# EAGLE design floppycontrol_mcu (EAGLE 9.6.2)
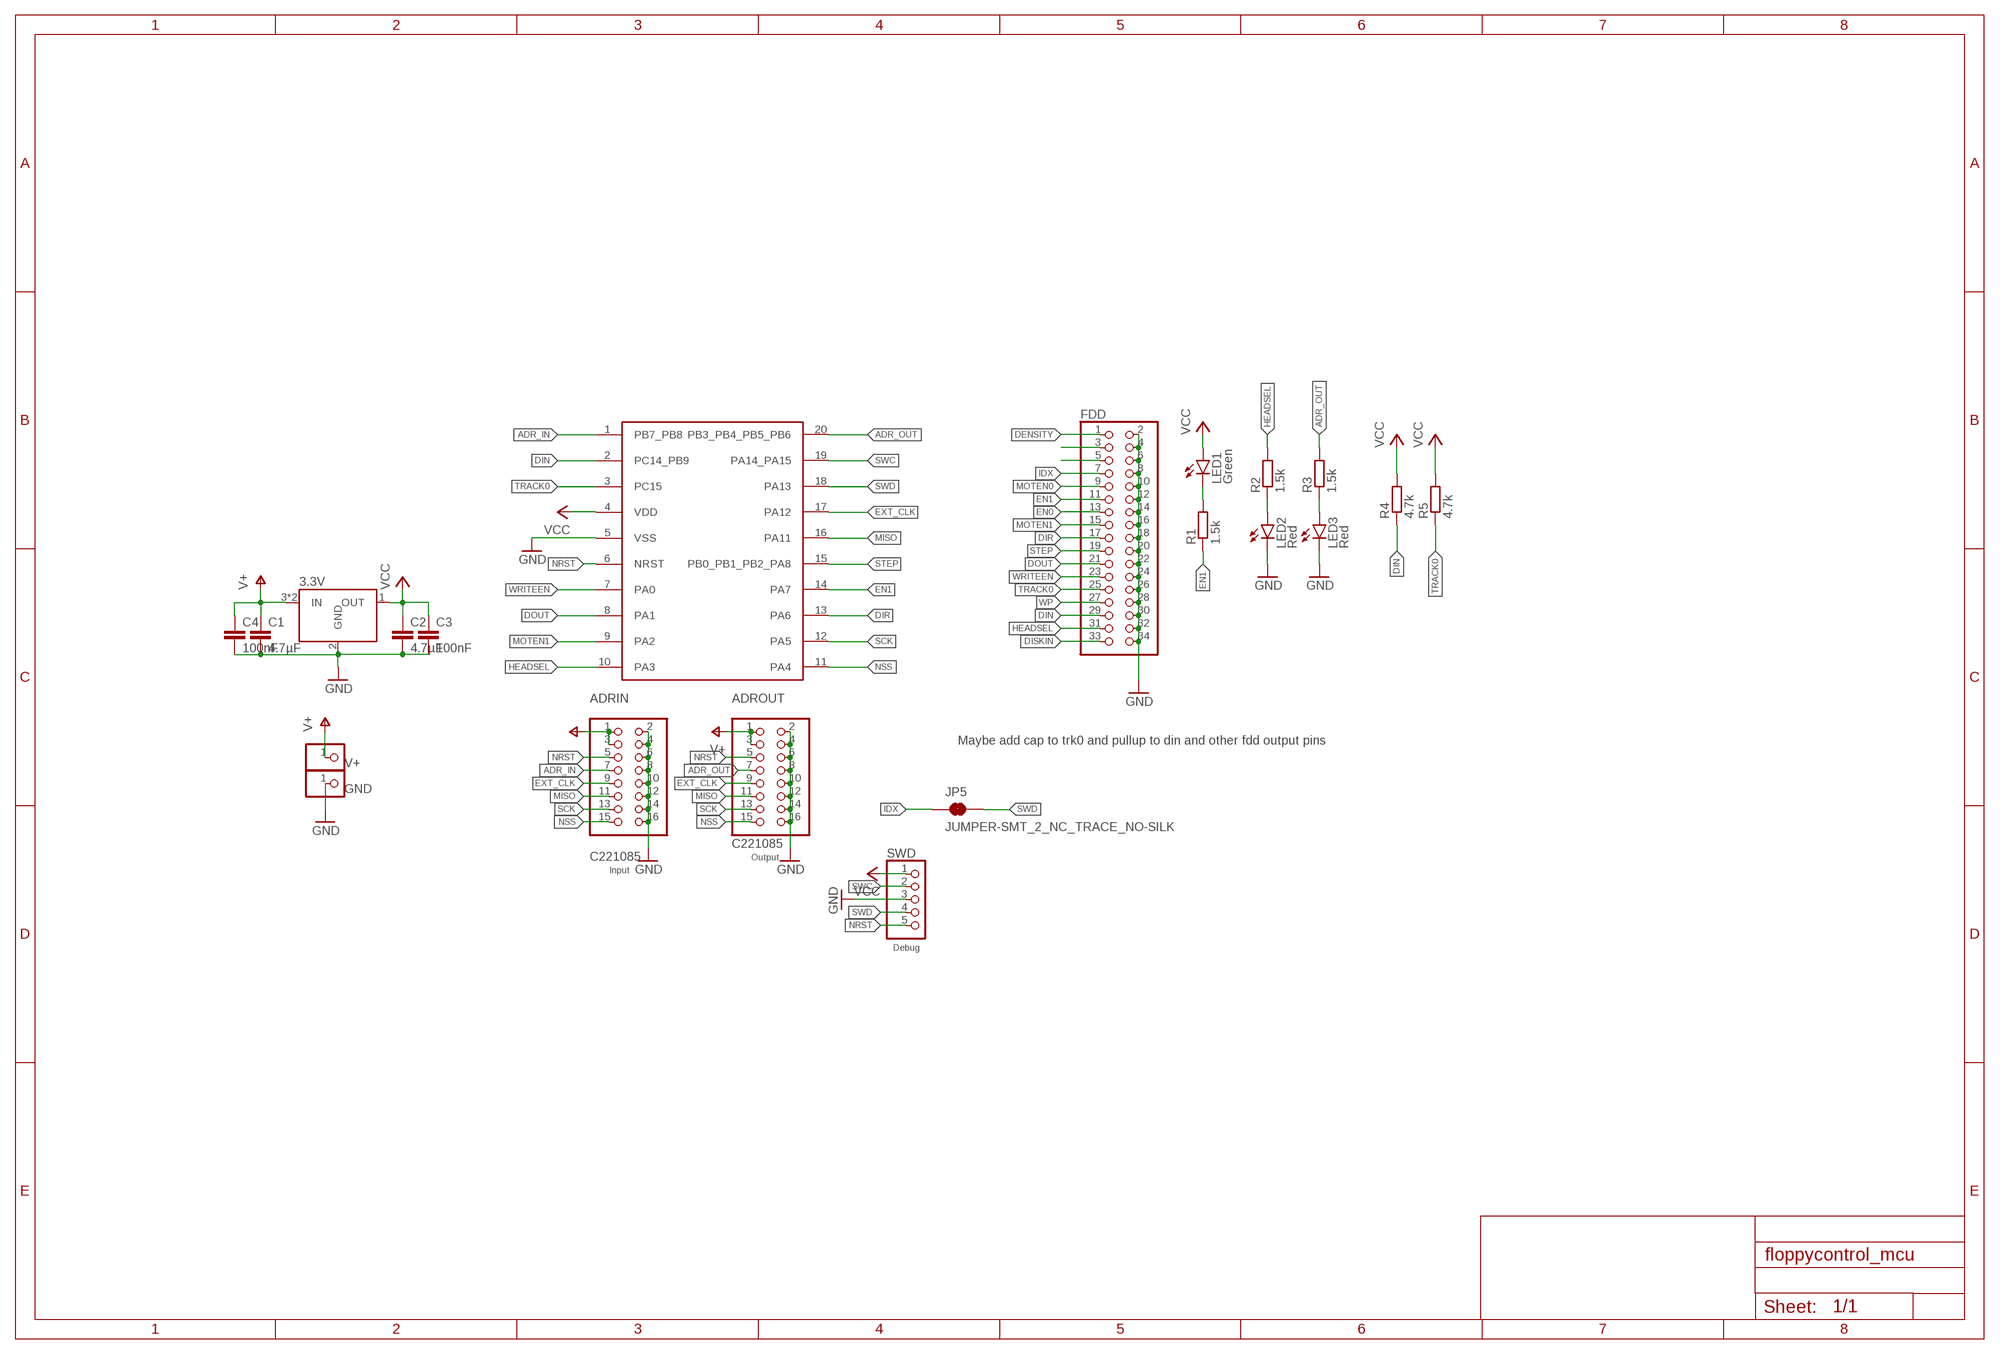
[diagram p0: schematic, sheet 1]

## Parts
ADRIN  C221085  PINHD-2X8/90  [2X08/90]
ADROUT  C221085  PINHD-2X8/90  [2X08/90]
C1  4.7µF  C-EUC0603  [C0603]
C2  4.7µF  C-EUC0603  [C0603]
C3  100nF  C-EUC0603  [C0603]
C4  100nF  C-EUC0603  [C0603]
FDD  PINHD-2X17/90  [2X17/90]
GND  PINHD-1X1  [1X01]
JP5  JUMPER-SMT_2_NC_TRACE_NO-SILK  [SMT-JUMPER_2_NC_TRACE_NO-SILK]
LED1  Green  LEDCHIP-LED0805  [CHIP-LED0805]
LED2  Red  LEDCHIP-LED0805  [CHIP-LED0805]
LED3  Red  LEDCHIP-LED0805  [CHIP-LED0805]
R1  1.5k  R-EU_R0603  [R0603]
R2  1.5k  R-EU_R0603  [R0603]
R3  1.5k  R-EU_R0603  [R0603]
R4  4.7k  R-EU_R0603  [R0603]
R5  4.7k  R-EU_R0603  [R0603]
SWD  PINHD-1X5  [1X05]
U1  STM32G030F6P6TSSOP20  [TSSOP20]
U2  3.3V  LDO_FIXEDSOT89_GND_VIN_VOUT  [SOT89-R]
V+  PINHD-1X1  [1X01]

## Nets
ADR_IN: ADRIN.7 U1.1(PB7_PB8)
ADR_OUT: ADROUT.7 R3.2 U1.20(PB3_PB4_PB5_PB6)
DENSITY: FDD.1
DIN: FDD.29 R4.1 U1.2(PC14_PB9)
DIR: FDD.17 U1.13(PA6)
DISKIN: FDD.33
DOUT: FDD.21 U1.8(PA1)
EN0: FDD.13
EN1: FDD.11 R1.1 U1.14(PA7)
EXT_CLK: ADRIN.9 ADROUT.9 U1.17(PA12)
GND: ADRIN.2 ADRIN.4 ADRIN.6 ADRIN.8 ADRIN.10 ADRIN.12 ADRIN.14 ADRIN.16 ADROUT.2 ADROUT.4 ADROUT.6 ADROUT.8 ADROUT.10 ADROUT.12 ADROUT.14 ADROUT.16 C1.2 C2.2 C3.2 C4.2 FDD.2 FDD.4 FDD.6 FDD.8 FDD.10 FDD.12 FDD.14 FDD.16 FDD.18 FDD.20 FDD.22 FDD.24 FDD.26 FDD.28 FDD.30 FDD.32 FDD.34 GND.1 LED2.C LED3.C SWD.3 U1.5(VSS) U2.2(GND)
HEADSEL: FDD.31 R2.2 U1.10(PA3)
IDX: FDD.7 JP5.1
MISO: ADRIN.11 ADROUT.11 U1.16(PA11)
MOTEN0: FDD.9
MOTEN1: FDD.15 U1.9(PA2)
N$1: LED1.C R1.2
N$2: FDD.3
N$3: FDD.5
N$4: LED2.A R2.1
N$5: LED3.A R3.1
NRST: ADRIN.5 ADROUT.5 SWD.5 U1.6(NRST)
NSS: ADRIN.15 ADROUT.15 U1.11(PA4)
SCK: ADRIN.13 ADROUT.13 U1.12(PA5)
STEP: FDD.19 U1.15(PB0_PB1_PB2_PA8)
SWC: SWD.2 U1.19(PA14_PA15)
SWD: JP5.2 SWD.4 U1.18(PA13)
TRACK0: FDD.25 R5.1 U1.3(PC15)
V+: ADRIN.1 ADRIN.3 ADROUT.1 ADROUT.3 C1.1 C4.1 U2.3(IN) U2.4(IN) V+.1
VCC: C2.1 C3.1 LED1.A R4.2 R5.2 SWD.1 U1.4(VDD) U2.1(OUT)
WP: FDD.27
WRITEEN: FDD.23 U1.7(PA0)

## Notes on the sheet
- Maybe add cap to trk0 and pullup to din and other fdd output pins
- Output
- Input
- Debug

## Library data of the parts
ADRIN ADROUT = pinhead:PINHD-2X8: PIN HEADER
C1-C4 = resistor:C-EU: CAPACITOR, European symbol
FDD = pinhead:PINHD-2X17: PIN HEADER
GND V+ = pinhead:PINHD-1X1: PIN HEADER
JP5 = SparkFun-Jumpers:JUMPER-SMT_2_NC_TRACE: Normally closed trace jumper This jumper has a trace between two pads so it's normally closed (NC). Use a razor knife to open the connection. For best results follow the IPC guidelines for cutting traces: Cutout at least 0.063 mm (0.005 in). Remove all loose material to clean up the cut area. Seal the cut with an approved epoxy. Reapply solder to reclose the connection.
LED1-LED3 = led:LED: LED OSRAM: - CHIPLED LG R971, LG N971, LY N971, LG Q971, LY Q971, LO R971, LY R971 LH N974, LH R974 LS Q976, LO Q976, LY Q976 LO Q996 - Hyper CHIPLED LW Q18S LB Q993, LB Q99A, LB R99A - SideLED LS A670, LO A670, LY A670, LG A670, LP A670 LB A673, LV A673, LT A673, LW A673 LH A674 LY A675 LS A676, LA A676, LO A676, LY A676, LW A676 LS A679, LY A679, LG A679 - Hyper Micro SIDELED® LS Y876, LA Y876, LO Y876, LY Y876 LT Y87S - SmartLED LW L88C, LW L88S LB L89C, LB L89S, LG L890 LS L89K, LO L89K, LY L89K LS L896, LA L896, LO L896, LY L896 - TOPLED LS T670, LO T670, LY T670, LG T670, LP T670 LSG T670, LSP T670, LSY T670, LOP T670, LYG T670 LG T671, LOG T671, LSG T671 LB T673, LV T673, LT T673, LW T673 LH T674 LS T676, LA T676, LO T676, LY T676, LB T676, LH T676, LSB T676, LW T676 LB T67C, LV T67C, LT T67C, LS T67K, LO T67K, LY T67K, LW E67C LS E67B, LA E67B, LO E67B, LY E67B, LB E67C, LV E67C, LT E67C LW T67C LS T679, LY T679, LG T679 LS T770, LO T770, LY T770, LG T770, LP T770 LB T773, LV T773, LT T773, LW T773 LH T774 LS E675, LA E675, LY E675, LS T675 LS T776, LA T776, LO T776, LY T776, LB T776 LHGB T686 LT T68C, LB T68C - Hyper Mini TOPLED® LB M676 - Mini TOPLED Santana® LG M470 LS M47K, LO M47K, LY M47K Source: http://www.osram.convergy.de LUXEON: - LUMILED® LXK2-PW12-R00, LXK2-PW12-S00, LXK2-PW14-U00, LXK2-PW14-V00 LXK2-PM12-R00, LXK2-PM12-S00, LXK2-PM14-U00 LXK2-PE12-Q00, LXK2-PE12-R00, LXK2-PE12-S00, LXK2-PE14-T00, LXK2-PE14-U00 LXK2-PB12-K00, LXK2-PB12-L00, LXK2-PB12-M00, LXK2-PB14-N00, LXK2-PB14-P00, LXK2-PB14-Q00 LXK2-PR12-L00, LXK2-PR12-M00, LXK2-PR14-Q00, LXK2-PR14-R00 LXK2-PD12-Q00, LXK2-PD12-R00, LXK2-PD12-S00 LXK2-PH12-R00, LXK2-PH12-S00 LXK2-PL12-P00, LXK2-PL12-Q00, LXK2-PL12-R00 Source: www.luxeon.com KINGBRIGHT: KA-3528ASYC Source: www.kingbright.com
R1-R5 = resistor:R-EU_: RESISTOR, European symbol
SWD = pinhead:PINHD-1X5: PIN HEADER
U1 = floppycontrol:STM32G030F6P6
U2 = motor_board_tmc:LDO_FIXED

## Board
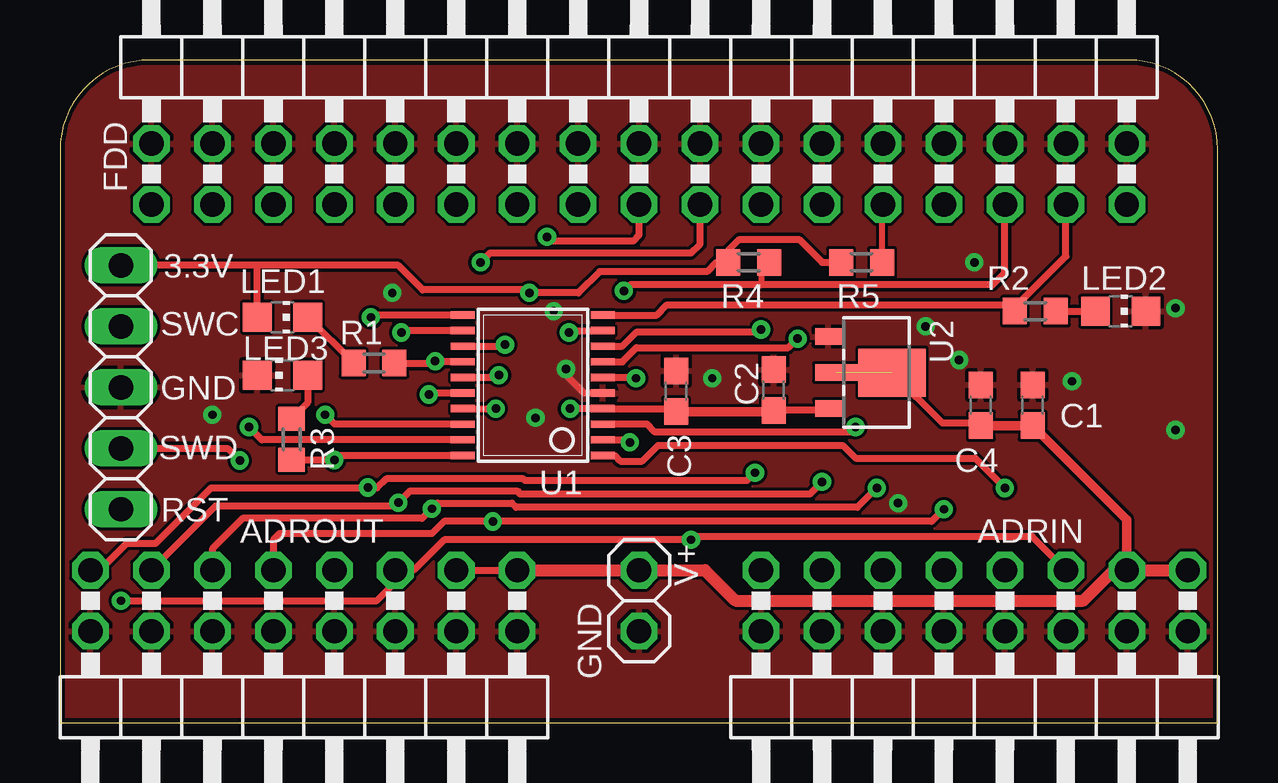
[diagram p1: board, top side]
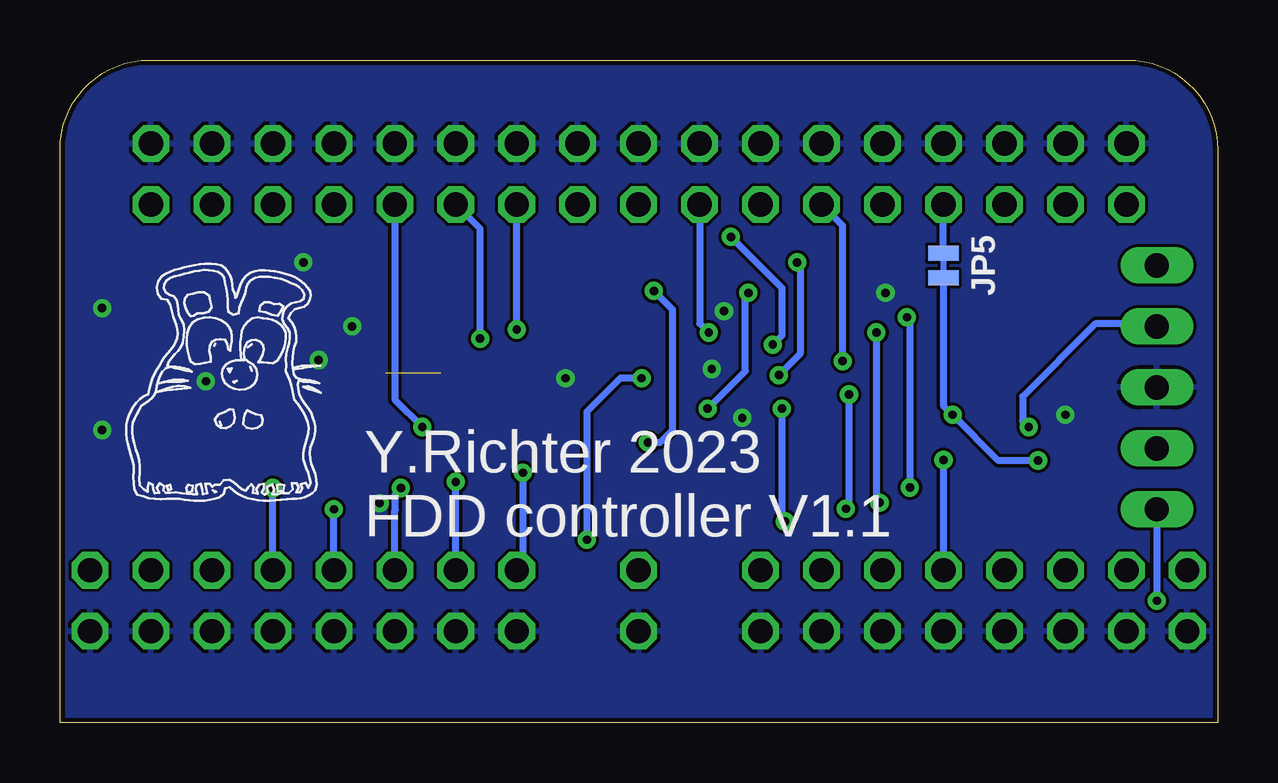
[diagram p2: board, bottom side, seen from below]

Size 48.24 x 27.61 mm. Coordinates in mm from the lower left corner, seen from the top.
Outline: 0,0 48.24,0 48.24,23.89 arc90 44.52,27.61 3.75,27.61 arc90 0,23.86 0,0
Copper layers (1*16): Top 0.035mm / dielectric 1.5mm / Bottom 0.035mm
Design rules "jlcpcb *": minimum track width 5mil, minimum drill 0.3mm, track to track 5mil, track to pad 5mil, pad to pad 5mil, via to via 5mil, smd to smd 0mil, copper to edge 0.2mm, drill to drill 8mil, minimum pad ring 10mil, minimum via ring 8mil, stop-mask expansion 4mil, vias tented up to drill 0.4mm, thermal gap 6mil

### Footprints (pad centres in the part's own frame; a part is rotated, then mirrored left to right if it is on the bottom)
2X08/90 = drill 1.016 octagon: 1 -8.89,-6.35; 2 -8.89,-3.81; 3 -6.35,-6.35; 4 -6.35,-3.81; 5 -3.81,-6.35; 6 -3.81,-3.81; 7 -1.27,-6.35; 8 -1.27,-3.81; 9 1.27,-6.35; 10 1.27,-3.81; 11 3.81,-6.35; 12 3.81,-3.81; 13 6.35,-6.35; 14 6.35,-3.81; 15 8.89,-6.35; 16 8.89,-3.81
C0603 = smd 1.1 x 1: 1 -0.85,0; 2 0.85,0
2X17/90 = drill 1.016 octagon: 1 -20.32,-6.35; 2 -20.32,-3.81; 3 -17.78,-6.35; 4 -17.78,-3.81; 5 -15.24,-6.35; 6 -15.24,-3.81; 7 -12.7,-6.35; 8 -12.7,-3.81; 9 -10.16,-6.35; 10 -10.16,-3.81; 11 -7.62,-6.35; 12 -7.62,-3.81; 13 -5.08,-6.35; 14 -5.08,-3.81; 15 -2.54,-6.35; 16 -2.54,-3.81; 17 0,-6.35; 18 0,-3.81; 19 2.54,-6.35; 20 2.54,-3.81; 21 5.08,-6.35; 22 5.08,-3.81; 23 7.62,-6.35; 24 7.62,-3.81; 25 10.16,-6.35; 26 10.16,-3.81; 27 12.7,-6.35; 28 12.7,-3.81; 29 15.24,-6.35; 30 15.24,-3.81; 31 17.78,-6.35; 32 17.78,-3.81; 33 20.32,-6.35; 34 20.32,-3.81
1X01 = drill 1.016 octagon: 1 0,0
SMT-JUMPER_2_NC_TRACE_NO-SILK = smd 0.635 x 1.27: 1 -0.508,0; 2 0.508,0
CHIP-LED0805 = smd 1.2 x 1.2: A 0,-1.05; C 0,1.05
R0603 = smd 1 x 1.1: 1 -0.85,0; 2 0.85,0
1X05 = drill 1.016 long: 1 -5.08,0; 2 -2.54,0; 3 0,0; 4 2.54,0; 5 5.08,0
TSSOP20 = smd 0.305 x 0.991: 1 -2.925,-2.918; 2 -2.275,-2.918; 3 -1.625,-2.918; 4 -0.975,-2.918; 5 -0.325,-2.918; 6 0.325,-2.918; 7 0.975,-2.918; 8 1.625,-2.918; 9 2.275,-2.918; 10 2.925,-2.918; 11 2.925,2.918; 12 2.275,2.918; 13 1.625,2.918; 14 0.975,2.918; 15 0.325,2.918; 16 -0.325,2.918; 17 -0.975,2.918; 18 -1.625,2.918; 19 -2.275,2.918; 20 -2.925,2.918
SOT89-R = smd 0.7 x 1.1: 1 1.5,-1.75; 2 -1.5,-1.75 | smd 0.7 x 1.8: 3 0,-1.4 | smd 2 x 2.8: 4 0,0.9

### Placement (x,y rotation side)
ADRIN  38.1,0 180 top
ADROUT  10.16,0 180 top
C1  40.53,13.22 90 top
C2  29.73,13.86 90 top
C3  25.67,13.81 90 top
C4  38.37,13.22 90 top
FDD  24.13,27.94 0 top
GND  24.13,3.81 0 top
JP5  11.43,19.05 270 bottom
LED1  9.27,16.89 270 top
LED2  44.2,17.14 270 top
LED3  9.27,14.48 90 top
R1  13.08,14.99 180 top
R2  40.64,17.14 180 top
R3  9.65,11.81 270 top
R4  28.7,19.18 180 top
R5  33.4,19.18 180 top
SWD  2.54,13.97 270 top
U1  19.7,14.06 90 top
U2  33.77,14.59 270 top
V+  24.13,6.35 0 top

### Tracks (layer width: path | path; a pad name or v marks a point on that pad's centre or on a via)
ADR_IN  (via drill 0.35)
  Top 0.3: U1.1 23.11,11.13 23.35,10.9 24.26,10.9 24.92,11.56 32.61,11.56 33.15,11.02 38.12,11.02 v39.37,9.78
  Bottom 0.3: ADRIN.7 v39.37,9.78
ADR_OUT  (via drill 0.35)
  Top 0.3: U1.20 11.7,11.13 11.51,10.94 v11.43,10.94 11.41,10.96 R3.2
  Bottom 0.3: v11.43,10.94 ADROUT.7
DIN  (via drill 0.35)
  Top 0.254: R4.1 29.21,18.84 29.21,18.24
  Top 0.3: U1.2 23.64,11.79 v23.74,11.68 | v23.5,17.99 23.75,18.24 29.21,18.24 38.86,18.24 39.37,18.75 FDD.29
  Bottom 0.3: v23.74,11.68 23.24,11.68 22.73,12.19 22.73,17.22 v23.5,17.99
DIR  (via drill 0.35)
  Top 0.3: U1.13 18.48,15.69 v18.54,15.75 | v20.29,20.24 20.46,20.07 23.88,20.07 24.13,20.32 FDD.17
  Bottom 0.3: v18.54,15.75 18.16,16.13 18.16,18.11 v20.29,20.24
DOUT  (via drill 0.35)
  Top 0.3: U1.8 23.43,15.69 24,16.26 29.08,16.26 v29.21,16.38
  Bottom 0.3: v29.21,16.38 FDD.21
EN1  (via drill 0.35)
  Top 0.3: U1.14 15.66,15.04 v15.63,15.06 15.52,14.96 13.96,14.96 R1.1
  Bottom 0.3: v15.63,15.06 15.63,20.71 FDD.11
EXT_CLK  (via drill 0.35)
  Top 0.3: v36.83,8.89 36.32,8.38 v18.03,8.38 16,8.38 15.49,7.87 9.14,7.87 8.89,7.62 ADROUT.9 | U1.17 v18.16,13.09 v18.16,13.08
  Bottom 0.3: ADRIN.9 v36.83,8.89 | v18.16,13.08 18.16,8.51 v18.03,8.38
GND  (via drill 0.35)
  Top 0.3: U1.5 21.85,13.73 21.08,14.5 v21.08,14.73
  other vias: 27.18,14.35 36.07,16.51 42.16,14.22 37.47,15.11 20.57,17.14 34.92,9.14 46.48,17.27 46.48,12.19 19.81,12.7 13.84,17.91 6.35,12.83 38.1,19.18
  pour Top: -0.64,27.94 -0.64,-0.51 49.53,-0.51 49.53,27.94
  pour Bottom: -0.64,27.94 -0.64,-0.64 49.53,-0.64 49.53,27.94
HEADSEL
  Top 0.3: U1.10 24.86,16.98 25.28,17.41 39.37,17.41 39.53,17.41 | 39.53,17.41 39.89,17.41 41.91,19.43 FDD.31 | R2.2 39.53,17.41
IDX
  Bottom 0.3: JP5.1 FDD.7
MISO  (via drill 0.35)
  Top 0.3: ADROUT.11 6.35,7.24 7.62,8.51 15.09,8.51 v15.49,8.91 15.73,9.14 18.83,9.14 19,8.97 33.23,8.97 v34.04,9.78 | U1.16 15.43,13.73 v15.37,13.67
  Bottom 0.3: ADRIN.11 34.29,8.85 34.27,8.87 34.27,9.54 v34.04,9.78 | v15.37,13.67 15.37,9.04 v15.49,8.91
MOTEN1  (via drill 0.35)
  Top 0.3: v21.21,16.26 21.29,16.34 U1.9
  Bottom 0.3: FDD.15 21.59,16.64 v21.21,16.26
N$1
  Top 0.3: R1.2 LED1.C
N$4
  Top 0.3: R2.1 LED2.A
N$5
  Top 0.3: LED3.A 10.32,13.33 R3.1
NRST  (via drill 0.35)
  Top 0.3: U1.6 23.97,14.38 v24,14.35 | ADRIN.5 40.51,7.75 26.42,7.75 v26.29,7.62 16,7.62 14.73,6.35 ADROUT.5 13.97,5.84 13.21,5.08 v2.54,5.08
  Bottom 0.3: v24,14.35 24.89,14.35 26.29,12.95 v26.29,7.62 | SWD.5 v2.54,5.08
NSS  (via drill 0.35)
  Top 0.3: 12.83,9.78 6.29,9.78 3.99,7.47 2.77,7.47 1.65,6.35 ADROUT.15 | 12.83,9.78 13.21,9.78 13.59,10.16 19.3,10.16 19.39,10.08 28.62,10.08 v28.96,10.41 | U1.11 13.05,16.98 v12.95,16.89 | v12.83,9.8 12.83,9.78
  Bottom 0.3: v28.96,10.41 28.96,6.6 ADRIN.15 | v12.95,16.89 12.83,16.76 v12.83,9.8
SCK  (via drill 0.35)
  Top 0.3: v31.75,10.03 31.24,9.53 19.18,9.53 19.05,9.65 14.59,9.65 v14.1,9.16 13.95,9.02 6.48,9.02 ADROUT.13 | U1.12 14.3,16.34 v14.22,16.26
  Bottom 0.3: ADRIN.13 v31.75,10.03 | v14.22,16.26 14.22,9.29 v14.1,9.16
STEP  (via drill 0.35)
  Top 0.3: U1.15 18.2,14.38 v18.29,14.48 | v17.53,19.18 17.91,19.56 26.29,19.56 26.67,19.94 FDD.19
  Bottom 0.3: v17.53,19.18 17.4,19.05 17.4,15.37 v18.29,14.48
SWC  (via drill 0.35)
  Top 0.3: v7.87,12.32 8.41,11.79 U1.19
  Bottom 0.3: v7.87,12.32 8.13,12.57 8.13,13.59 5.08,16.64 2.67,16.64 SWD.2
SWD  (via drill 0.35)
  Top 0.3: U1.18 11.44,12.44 v11.05,12.83 | SWD.4 6.99,11.43 v7.49,10.92
  Bottom 0.3: JP5.2 11.43,13.21 v11.05,12.83 9.14,10.92 v7.49,10.92
TRACK0  (via drill 0.35)
  Top 0.254: R5.1 34.25,21.55 FDD.25
  Top 0.3: v33.15,12.32 32.93,12.1 24.79,12.1 24.46,12.44 U1.3
  Bottom 0.3: FDD.25 34.29,13.46 v33.15,12.32
V+  (1 unrouted)
  Top 0.3: ADROUT.3 ADROUT.1 | U2.4 36.77,12.49 38.26,12.49
  Top 0.4: 38.26,12.49 C4.1 C1.1 44.45,8.45 ADRIN.3
  Top 0.5: ADRIN.1 ADRIN.3 43.9,6.35 42.64,5.08 28.14,5.08 26.87,6.35 V+.1 ADROUT.1
VCC  (via drill 0.35)
  Top 0.3: C3.1 25.54,13.09 U1.4 v21.25,13.08 | 8.26,19.05 14.1,19.05 15.11,18.03 19.43,18.03 v19.56,17.91 21.6,17.91 22.49,18.8 26.96,18.8 27.34,19.18 R4.2 27.85,19.68 28.3,20.13 30.8,20.13 31.76,19.18 R5.2 | 8.26,19.05 SWD.1 | LED1.A 8.22,19.02 8.26,19.05 | U2.1 31.94,13.01 30.14,13.01
  Top 0.4: 30.14,13.01 C2.1 29.68,12.96 C3.1
  Bottom 0.3: v21.25,13.08 19.68,14.65 19.68,17.78 v19.56,17.91
WRITEEN  (via drill 0.35)
  Top 0.3: U1.7 23.43,15.04 24.01,15.62 30.35,15.62 v30.73,16
  Bottom 0.3: v30.73,16 30.73,20.57 FDD.23

### Text on the board
tPlace: 3.3V | SWC | GND | RST
bPlace: Y.Richter 2023 / FDD controller V1.1